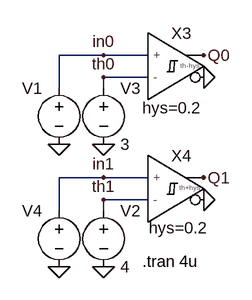
[diagram p0: schematic test-comp_hys-fast.asc]
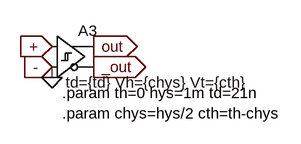
[diagram p1: sub-circuit comp_hys-fall-fast.asc]
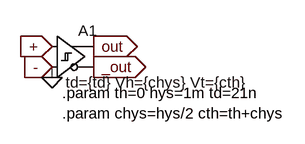
[diagram p2: sub-circuit comp_hys-rise-fast.asc]
test-comp_hys-fast.asc, the LTspice schematic file:
Version 4
SHEET 1 880 680
WIRE 48 96 -16 96
WIRE 112 96 48 96
WIRE 112 128 48 128
WIRE -16 144 -16 96
WIRE 48 144 48 128
WIRE 48 272 -16 272
WIRE 112 272 48 272
WIRE 112 304 48 304
WIRE -16 320 -16 272
WIRE 48 320 48 304
FLAG -16 224 0
FLAG 48 400 0
FLAG 48 128 th0
FLAG 48 96 in0
FLAG 192 128 0
FLAG 192 96 Q0
FLAG 192 272 Q1
FLAG 48 304 th1
FLAG 48 224 0
FLAG -16 400 0
FLAG 48 272 in1
FLAG 192 304 0
SYMBOL voltage -16 128 M0
WINDOW 3 24 96 Invisible 2
WINDOW 123 0 0 Left 0
WINDOW 39 0 0 Left 0
SYMATTR Value PULSE(2.5 3.5 0 1u 1u 1n 2u)
SYMATTR InstName V1
SYMBOL voltage 48 304 R0
SYMATTR InstName V2
SYMATTR Value 4
SYMBOL voltage 48 128 R0
SYMATTR InstName V3
SYMATTR Value 3
SYMBOL voltage -16 304 M0
WINDOW 3 24 96 Invisible 2
WINDOW 123 0 0 Left 0
WINDOW 39 0 0 Left 0
SYMATTR Value PULSE(3.5 4.5 0 1u 1u 1n 2u)
SYMATTR InstName V4
SYMBOL comp_hys-fall-fast 144 112 R0
WINDOW 39 3 75 Bottom 2
SYMATTR InstName X3
SYMATTR SpiceLine hys=0.2
SYMBOL comp_hys-rise-fast 144 288 R0
WINDOW 39 12 72 Bottom 2
SYMATTR InstName X4
SYMATTR SpiceLine hys=0.2
TEXT 104 392 Left 2 !.tran 4u

comp_hys-fall-fast.asc, the sub-circuit schematic file:
Version 4
SHEET 1 880 680
FLAG 224 160 out
IOPIN 224 160 Out
FLAG 224 192 _out
IOPIN 224 192 Out
FLAG 160 192 -
IOPIN 160 192 In
FLAG 160 160 +
IOPIN 160 160 In
FLAG 160 208 0
SYMBOL Digital\\diffschmitt 160 112 R0
WINDOW 3 21 104 Left 0
SYMATTR Value td={td} Vh={chys} Vt={cth}
SYMATTR InstName A3
TEXT 176 232 Left 0 !.param th=0 hys=1m td=21n\n.param chys=hys/2 cth=th-chys

comp_hys-rise-fast.asc, the sub-circuit schematic file:
Version 4
SHEET 1 880 680
FLAG 256 80 out
IOPIN 256 80 Out
FLAG 256 112 _out
IOPIN 256 112 Out
FLAG 192 112 -
IOPIN 192 112 In
FLAG 192 80 +
IOPIN 192 80 In
FLAG 192 128 0
SYMBOL Digital\\diffschmitt 192 32 R0
WINDOW 3 21 104 Left 0
SYMATTR Value td={td} Vh={chys} Vt={cth}
SYMATTR InstName A1
TEXT 208 152 Left 0 !.param th=0 hys=1m td=21n\n.param chys=hys/2 cth=th+chys

The netlist it stands for:
* test-comp_hys-fast.asc
V1 in0 0 PULSE(2.5 3.5 0 1u 1u 1n 2u)
V2 th1 0 4
V3 th0 0 3
V4 in1 0 PULSE(3.5 4.5 0 1u 1u 1n 2u)
XX3 in0 th0 0 Q0 comp_hys-fall-fast params: hys=0.2
XX4 in1 th1 0 Q1 comp_hys-rise-fast params: hys=0.2

* block symbol definitions
.subckt comp_hys-fall-fast + - _out out
A3 + - 0 0 0 _out out 0 SCHMITT td={td} Vh={chys} Vt={cth}
.param th=0 hys=1m td=21n
.param chys=hys/2 cth=th-chys
.ends comp_hys-fall-fast

.subckt comp_hys-rise-fast + - _out out
A1 + - 0 0 0 _out out 0 SCHMITT td={td} Vh={chys} Vt={cth}
.param th=0 hys=1m td=21n
.param chys=hys/2 cth=th+chys
.ends comp_hys-rise-fast

.tran 4u
.backanno
.end